# EAGLE design schematic (EAGLE 9.6.2)
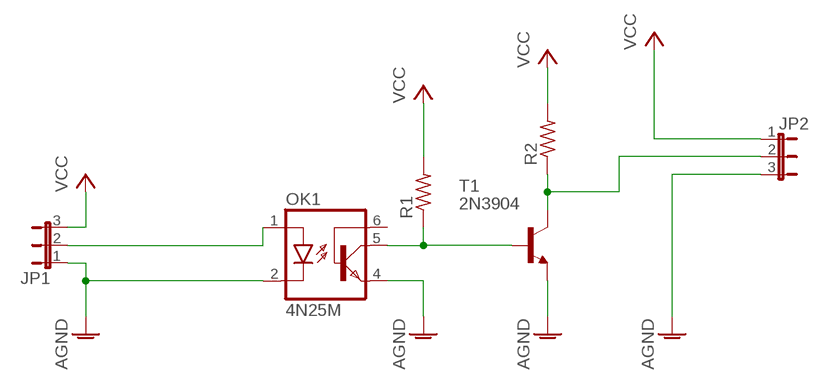
[diagram p0: schematic, sheet 1]

## Parts
JP1  JP2E  [JP2]
JP2  JP2E  [JP2]
OK1  4N25M  [DIL06]
R1  R-US_0207/10  [0207/10]
R2  R-US_0207/10  [0207/10]
T1  2N3904  [TO92]

## Nets
AGND: JP1.1 JP2.3 OK1.2(C) OK1.4(EMI) T1.3(E)
N$1: JP1.2 OK1.1(A)
N$3: OK1.5(COL) R1.1 T1.2(B)
N$4: JP2.2 R2.1 T1.1(C)
VCC: JP1.3 JP2.1 R1.2 R2.2
Unconnected: OK1.6(BAS)

## Library data of the parts
JP1 JP2 = jumper:JP2E: JUMPER
OK1 = optocoupler:4N*?M: General Purpose 6-Pin Phototransistor Optocouplers Source: http://www.fairchildsemi.com/ds/4N/4N35-M.pdf; MPN: 4N25-M; OC_FARNELL: 1021349; OC_NEWARK: 98K9084
R1 R2 = rcl:R-US_: RESISTOR, American symbol; SPICEPREFIX: R
T1 = transistor:2N3904: NPN TRANSISTOR

## Board
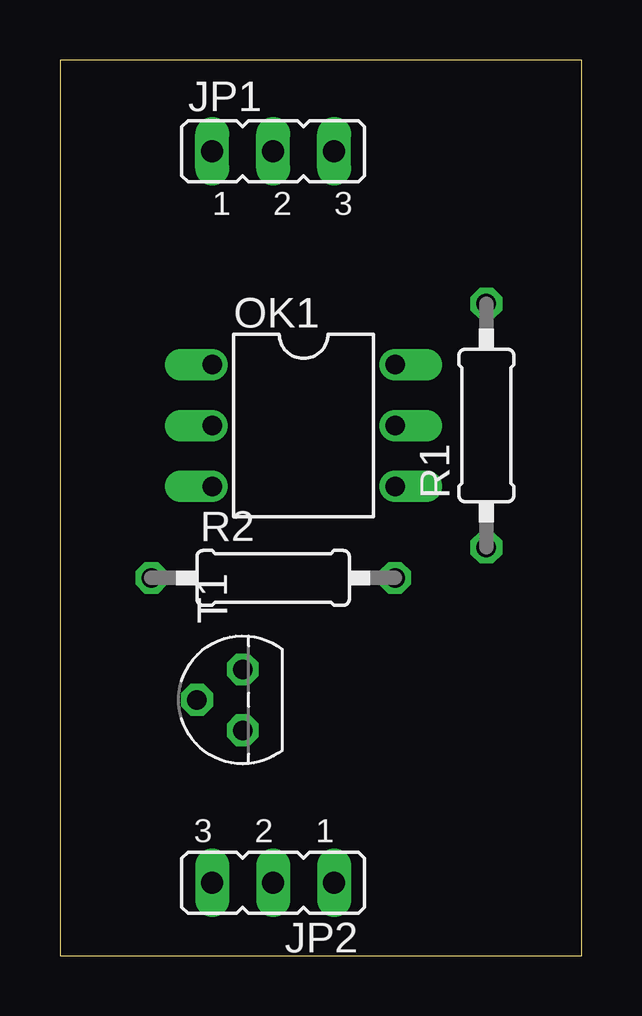
[diagram p1: board, top side]
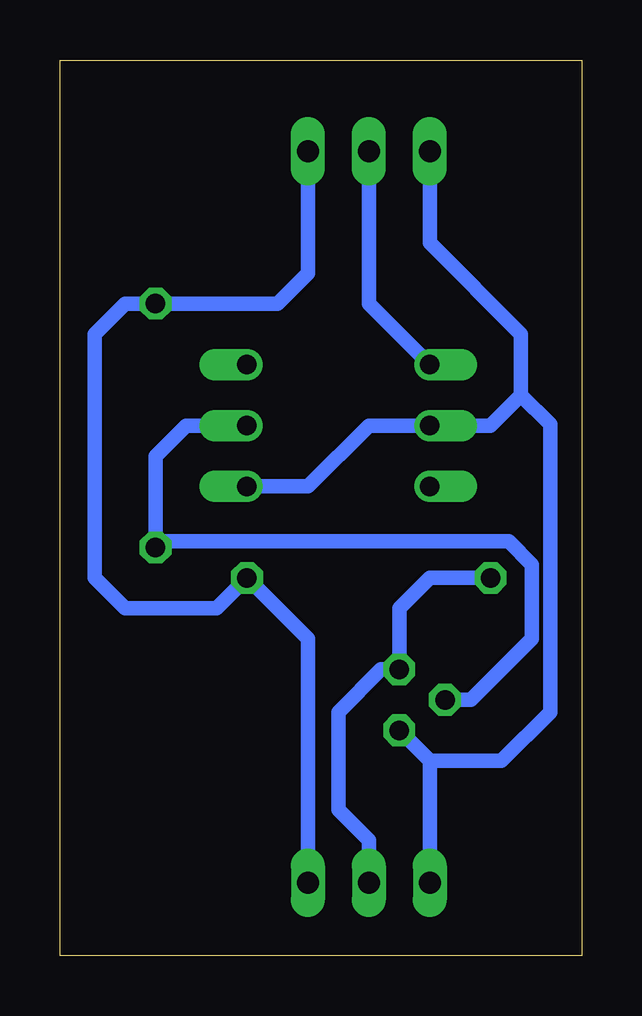
[diagram p2: board, bottom side, seen from below]

Size 21.77 x 37.33 mm. Coordinates in mm from the lower left corner, seen from the top.
Outline: 0,0 21.77,0 21.77,37.33 0,37.33 0,0
Copper layers (1*16): Top 0.035mm / dielectric 1.5mm / Bottom 0.035mm
Design rules "default": minimum track width 6mil, minimum drill 0.35mm, track to track 6mil, track to pad 6mil, pad to pad 6mil, via to via 6mil, smd to smd 6mil, copper to edge 40mil, drill to drill 6mil, minimum pad ring 10mil, minimum via ring 8mil, stop-mask expansion 4mil, vias tented up to drill 0mil, thermal gap 10mil

### Footprints (pad centres in the part's own frame; a part is rotated, then mirrored left to right if it is on the bottom)
JP2 = drill 0.914 long: 1 -2.54,0; 2 0,0; 3 2.54,0
DIL06 = drill 0.813 offset: 1 -2.54,-3.81; 2 0,-3.81; 3 2.54,-3.81; 4 2.54,3.81; 5 0,3.81; 6 -2.54,3.81
0207/10 = drill 0.813 octagon: 1 -5.08,0; 2 5.08,0
TO92 = drill 0.813 octagon: 1 1.27,0; 2 0,1.905; 3 -1.27,0

### Placement (x,y rotation side)
JP1  8.89,33.53 0 top
JP2  8.89,3.05 180 top
OK1  10.16,22.1 270 top
R1  17.78,22.1 90 top
R2  8.89,15.75 0 top
T1  7.62,10.67 90 top

### Tracks (layer width: path | path; a pad name or v marks a point on that pad's centre or on a via)
AGND
  Bottom 0.61: JP1.1 6.35,29.72 2.54,25.91 2.54,23.37 | 2.54,23.37 3.81,22.1 OK1.2 8.89,22.1 11.43,19.56 OK1.4 | T1.3 6.35,8.13 | 6.35,8.13 JP2.3 | 2.54,23.37 1.32,22.15 1.32,10.16 3.35,8.13 6.35,8.13
N$1
  Bottom 0.61: OK1.1 8.89,27.18 JP1.2
N$3
  Bottom 0.61: OK1.5 16.51,22.1 17.78,20.83 R1.1 17.53,17.27 3.05,17.27 2.08,16.31 2.08,13.21 4.62,10.67 T1.2
N$4
  Bottom 0.61: R2.1 6.35,15.75 7.62,14.48 T1.1 8.38,11.94 10.16,10.16 10.16,6.1 8.89,4.83 JP2.2
VCC
  Bottom 0.61: JP1.3 11.43,28.45 12.7,27.18 R1.2 19.05,27.18 20.32,25.91 20.32,15.75 19.05,14.48 15.24,14.48 R2.2 11.43,13.21 JP2.1